# Altium schematic sheet usb_otg.SchDoc
size A4
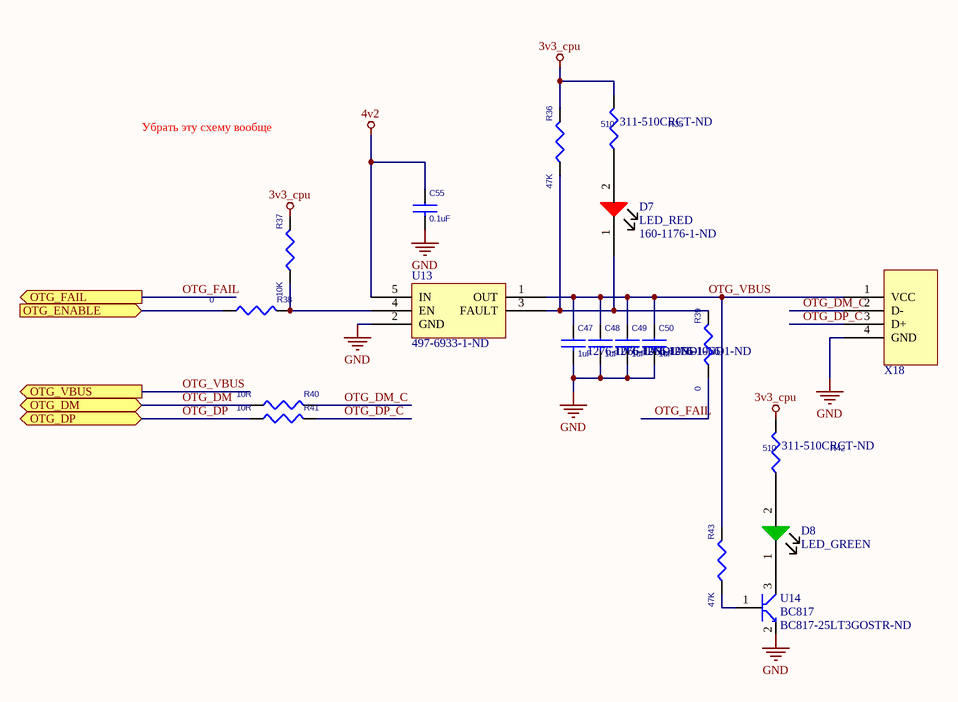
[diagram p0: usb_otg.SchDoc]

## Parts
C47  1uF  Supplier Part Number 1: 1276-1066-1-ND  [CAPC2012X09M]
C48  1uF  Supplier Part Number 1: 1276-1066-1-ND  [CAPC2012X09M]
C49  1uF  Supplier Part Number 1: 1276-1066-1-ND  [CAPC2012X09M]
C50  1uF  Supplier Part Number 1: 1276-1066-1-ND  [CAPC2012X09M]
C55  0.1uF  [CAPC2012X09M]
D7  LED_RED  Supplier Part Number 1: 160-1176-1-ND  [DIOC2012X11N]
D8  LED_GREEN  [DIOC2012X11N]
R35  510  Supplier Part Number 1: 311-510CRCT-ND  [RESC2013X06M]
R36  47K  [RESC2013X06M]
R37  10K  [RESC2013X06M]
R38  0  [RESC2013X06M]
R39  0  [RESC2013X06M]
R40  10R  [RESC2013X06M]
R41  10R  [RESC2013X06M]
R42  510  Supplier Part Number 1: 311-510CRCT-ND  [RESC2013X06M]
R43  47K  [RESC2013X06M]
U13  Supplier Part Number 1: 497-6933-1-ND  [SOT95P280X145-5N]  (hidden comment: STMPS2141STR)
U14  BC817  Supplier Part Number 1: BC817-25LT3GOSTR-ND  [SOT95P237X111-3N_SOT-23]
X18  743941-da-01  [USB-A]  (value not drawn)

## Ports
OTG_DM (bidir), OTG_DP (bidir), OTG_ENABLE (in), OTG_FAIL (out), OTG_VBUS (out)

## Nets
3v3_cpu: R35.2 R36.2 R37.2 R42.2
4v2: C55.1 U13.5(IN)
GND: C47.2 C48.2 C49.2 C50.2 C55.2 U13.2(GND) U14.2(E) X18.4(GND)
OTG_DM: R40.1 ; port OTG_DM
OTG_DM_C: R40.2 X18.2(D-)
OTG_DP: R41.1 ; port OTG_DP
OTG_DP_C: R41.2 X18.3(D+)
OTG_ENABLE: R38.1 ; port OTG_ENABLE
OTG_FAIL: R39.1 ; port OTG_FAIL
OTG_VBUS: C47.1 C48.1 C49.1 C50.1 R43.2 U13.1(OUT) X18.1(VCC) ; port OTG_VBUS
NetD7_1: D7.1(C) R36.1 R39.2 U13.3(FAULT)
NetD7_2: D7.2(A) R35.1
NetD8_1: D8.1(C) U14.3(C)
NetD8_2: D8.2(A) R42.1
NetR37_1: R37.1 R38.2 U13.4(EN)
NetR43_1: R43.1 U14.1(B)

## Notes on the sheet
- Убрать эту схему вообще

## Library data of the parts
C47-C50 = CAP_SMD_1uF_10%: MLCC; 1uF; 25V; X7R; ±10%; SMD; 0805;; Value: 1uF; Supplier 1: Digi-Key
C55 = CAP_SMD_0.1UF_10%: CAP CER 0.1UF 25V 10% X7R 0805; Value: 0.1uF; Supplier 1: Digi-Key; Supplier Part Number 1: 399-1168-6-ND
R35 R42 = RES_SMD_510_5%: RES - 510 OHM, 5%, 1/8W, 0805 SMD; Supplier 1: Digi-Key
R36 R43 = RES_SMD_47K_1%: RES 47K OHM 1/8W 1% 0805; Supplier 1: Digi-Key; Supplier Part Number 1: 1276-5377-2-ND
R37 = RES_SMD_10K_5%: RES 10K OHM 1/8W 5% 0805 SMD; Supplier 1: Digi-Key; Supplier Part Number 1: 311-10KARCT-ND
R38 R39 = RES_SMD_0: RES 0.0 OHM 1/8W JUMP 0805 SMD; Supplier 1: Digi-Key; Supplier Part Number 1: P0.0ATR-ND
R40 R41 = RES_SMD_10R_5%: RES 10 OHM 1/8W 1% 0805 SMD; Supplier 1: Digi-Key; Supplier Part Number 1: P10.0CCT-ND
X18 = USB-A-FEMALE
D7 = LED_RED: Supplier 1: Digi-Key
D8 = LED_GREEN: Supplier 1: Digi-Key; Supplier Part Number 1: 160-1179-2-ND
U13 = STMPS2141STR: Supplier 1: Digi-Key
U14 = BC817: Supplier 1: Digi-Key